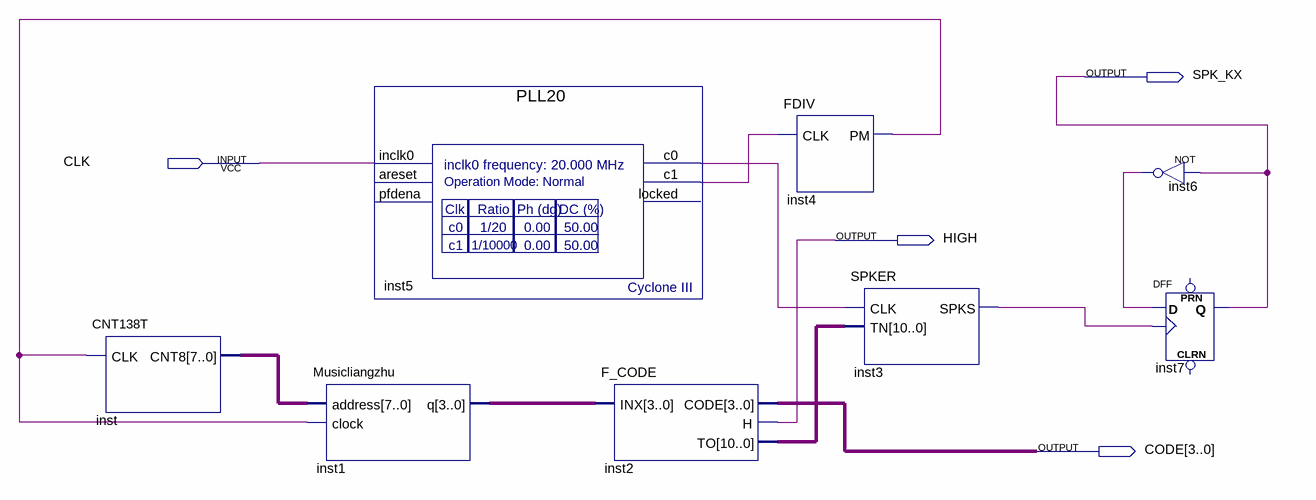
[diagram p0: schematic sheet]
// Quartus schematic Music.bdf as structural Verilog: 8 symbols, 4 pins
module Music (
  input  CLK,
  output SPK_KX,
  output HIGH,
  output [3:0] CODE
);

  wire inst3_spks, inst4_pm, inst5_c0, inst5_c1, inst6_out;
  wire [3:0] inst1_q;
  wire [7:0] inst_cnt8;
  wire [10:0] inst2_to;

  CNT138T inst (.CLK(inst4_pm), .CNT8(inst_cnt8));
  PLL20 inst5 (.inclk0(CLK), .c0(inst5_c0), .c1(inst5_c1));  // open: areset, pfdena, locked
  Musicliangzhu inst1 (.address(inst_cnt8), .clock(inst4_pm), .q(inst1_q));
  F_CODE inst2 (.INX(inst1_q), .CODE(CODE), .H(HIGH), .TO(inst2_to));
  FDIV inst4 (.CLK(inst5_c1), .PM(inst4_pm));
  SPKER inst3 (.CLK(inst5_c0), .TN(inst2_to), .SPKS(inst3_spks));
  not inst6 (inst6_out, SPK_KX);
  DFF inst7 (.CLK(inst3_spks), .D(inst6_out), .Q(SPK_KX));  // open: CLRN, PRN
endmodule
